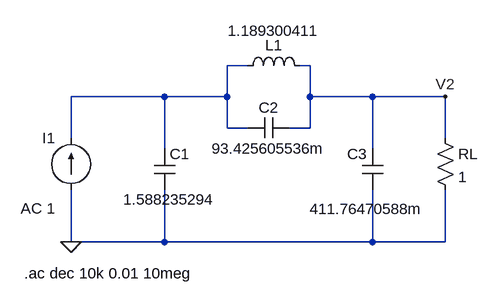
[diagram p0: schematic Punto2.asc]
Punto2.asc, the LTspice schematic file:
Version 4
SHEET 1 880 680
WIRE 288 16 256 16
WIRE 384 16 368 16
WIRE 160 64 16 64
WIRE 256 64 256 16
WIRE 256 64 160 64
WIRE 384 64 384 16
WIRE 480 64 384 64
WIRE 592 64 480 64
WIRE 256 112 256 64
WIRE 288 112 256 112
WIRE 384 112 384 64
WIRE 384 112 352 112
WIRE 16 128 16 64
WIRE 592 128 592 64
WIRE 160 144 160 64
WIRE 480 144 480 64
WIRE 16 288 16 208
WIRE 160 288 160 208
WIRE 160 288 16 288
WIRE 480 288 480 208
WIRE 480 288 160 288
WIRE 592 288 592 208
WIRE 592 288 480 288
FLAG 16 288 0
FLAG 592 64 V2
SYMBOL cap 144 144 R0
WINDOW 3 -48 78 Left 2
SYMATTR Value 1.588235294
SYMATTR InstName C1
SYMBOL cap 352 96 R90
WINDOW 0 0 32 VBottom 2
WINDOW 3 32 32 VTop 2
SYMATTR InstName C2
SYMATTR Value 93.425605536m
SYMBOL cap 496 208 R180
WINDOW 0 24 56 Left 2
WINDOW 3 -63 -29 Left 2
SYMATTR InstName C3
SYMATTR Value 411.76470588m
SYMBOL ind 272 32 R270
WINDOW 0 32 56 VTop 2
WINDOW 3 85 56 VBottom 2
SYMATTR InstName L1
SYMATTR Value 1.189300411
SYMBOL res 576 112 R0
SYMATTR InstName RL
SYMATTR Value 1
SYMBOL current 16 208 R180
WINDOW 0 24 80 Left 2
WINDOW 3 24 0 Left 2
WINDOW 123 24 -28 Left 2
WINDOW 39 0 0 Left 0
SYMATTR InstName I1
SYMATTR Value ""
SYMATTR Value2 AC 1
TEXT -56 336 Left 2 !.ac dec 10k 0.01 10meg

The netlist it stands for:
* Punto2.asc
C1 N001 0 1.588235294
C2 V2 N001 93.425605536m
C3 0 V2 411.76470588m
L1 N001 V2 1.189300411
RL V2 0 1
I1 0 N001 AC 1
.ac dec 10k 0.01 10meg
.backanno
.end